# EAGLE schematic MotorBoard (EAGLE 9.2.1)
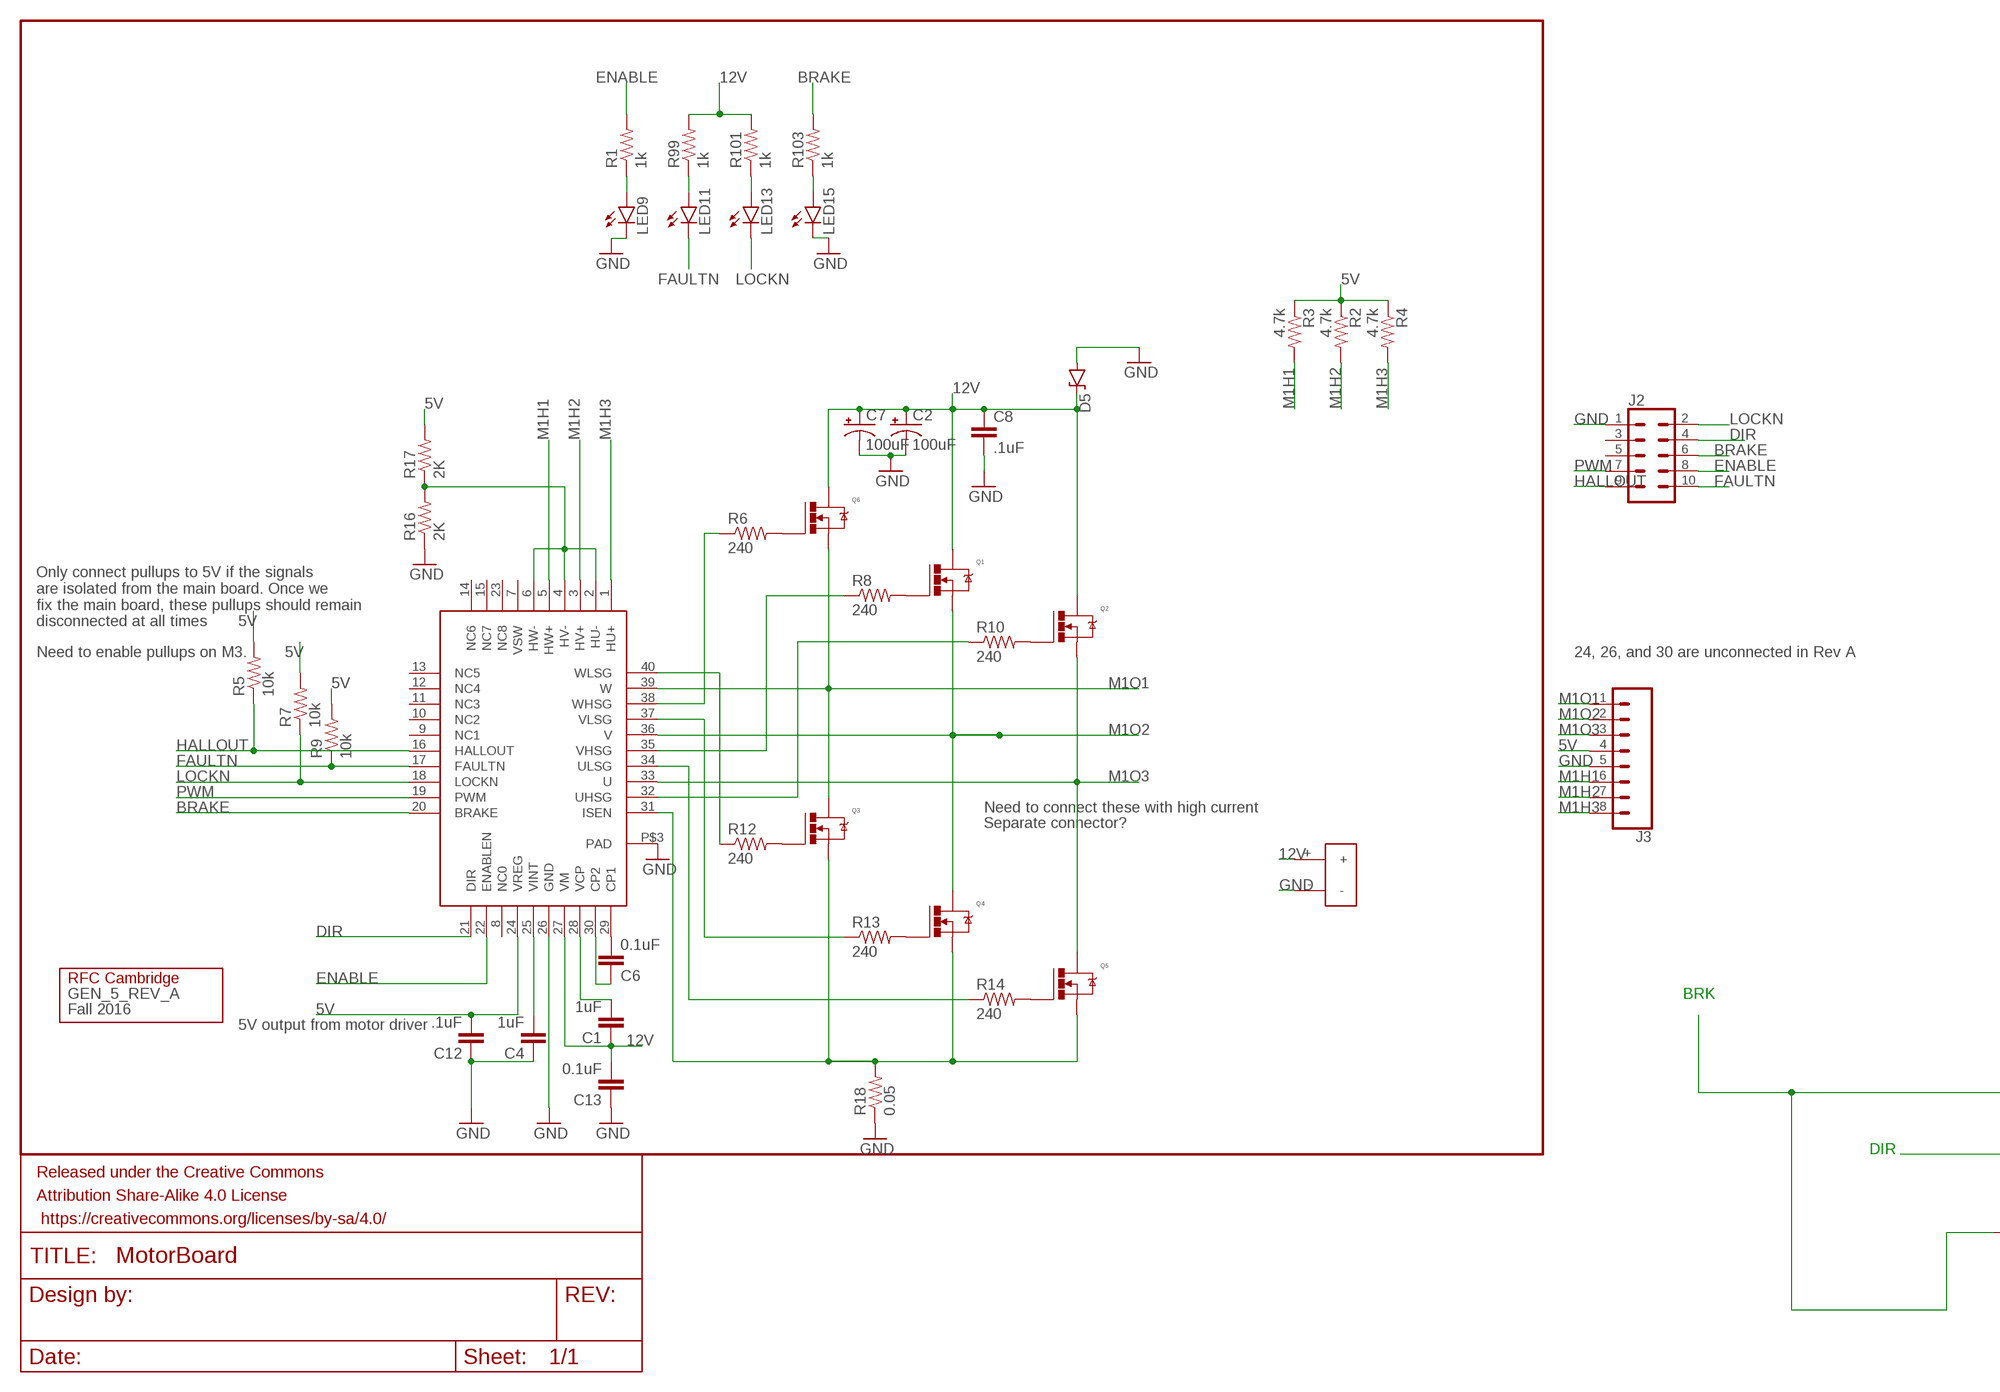
[diagram p0: schematic, sheet 1, part 1 of 2]
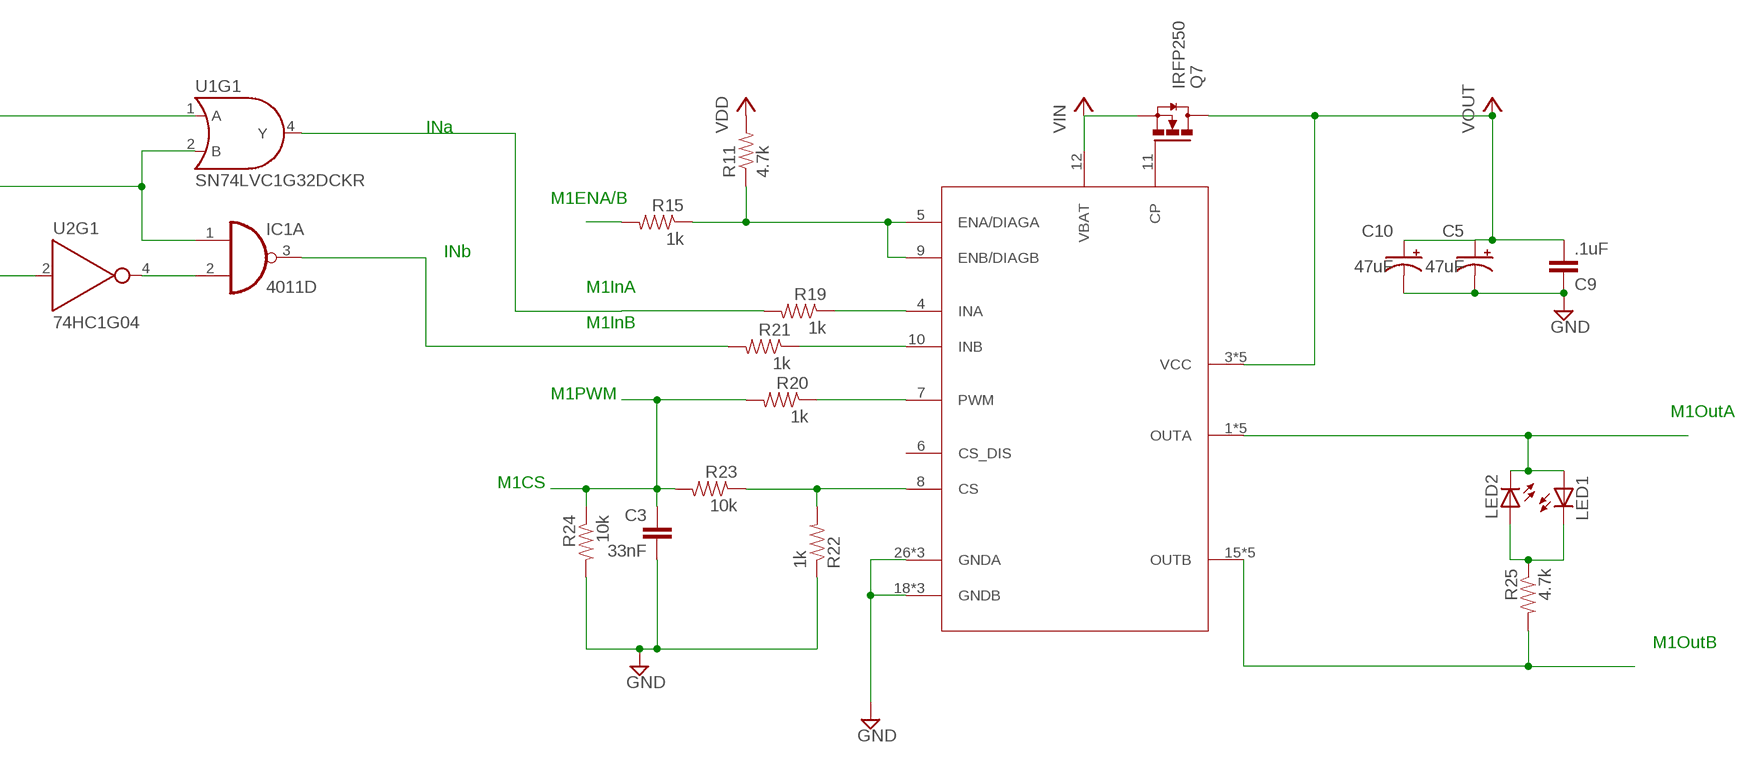
[diagram p1: schematic, sheet 1, part 2 of 2]

## Parts
C1  1uF  CAP0805  [0805]
C2  100uF  CAP-POLAR  [PANASONIC_D]
C3  33nF  CAP0805  [0805]
C4  1uF  CAP0805  [0805]
C5  47uF  CPOL-US085CS-1AW  [085CS_1AW]
C6  0.1uF  CAP0805  [0805]
C7  100uF  CAP-POLAR  [PANASONIC_D]
C8  .1uF  CAP0805  [0805]
C9  .1uF  CAP0805  [0805]
C10  47uF  CPOL-US085CS-1AW  [085CS_1AW]
C12  .1uF  CAP0805  [0805]
C13  0.1uF  CAP0805  [0805]
D5  DIODE-ZENERDO214AC  [DO214AC]
FRAME7  FRAME-LETTER  [CREATIVE_COMMONS]
GEN_5_REV_A  Fall 2016  LOGO  [LOGO]
IC1  4011D  [SO14]
J2  CONN_05X2SHD  [2X5-SHROUDED]
J3  CONN_08LONGPADS  [1X08_LONGPADS]
LED1  LED  [SMARTLED-TTW]
LED2  LED  [SMARTLED-TTW]
LED9  LED1206  [LED-1206]
LED11  LED1206  [LED-1206]
LED13  LED1206  [LED-1206]
LED15  LED1206  [LED-1206]
Q1  N-MOSFET  [DPAK]
Q2  N-MOSFET  [DPAK]
Q3  N-MOSFET  [DPAK]
Q4  N-MOSFET  [DPAK]
Q5  N-MOSFET  [DPAK]
Q6  N-MOSFET  [DPAK]
Q7  IRFP250  [TO-247AD-V]
R1  1k  RESISTOR0805-RES  [0805]
R2  4.7k  RESISTOR0805-RES  [0805]
R3  4.7k  RESISTOR0805-RES  [0805]
R4  4.7k  RESISTOR0805-RES  [0805]
R5  10k  RESISTOR0805-RES  [0805]
R6  240  RESISTOR0805-RES  [0805]
R7  10k  RESISTOR0805-RES  [0805]
R8  240  RESISTOR0805-RES  [0805]
R9  10k  RESISTOR0805-RES  [0805]
R10  240  RESISTOR0805-RES  [0805]
R11  4.7k  RESISTOR0805-RES  [0805]
R12  240  RESISTOR0805-RES  [0805]
R13  240  RESISTOR0805-RES  [0805]
R14  240  RESISTOR0805-RES  [0805]
R15  1k  RESISTOR0805-RES  [0805]
R16  2K  RESISTOR0805-RES  [0805]
R17  2K  RESISTOR0805-RES  [0805]
R18  0.05  R-US_R2512  [R2512]
R19  1k  RESISTOR0805-RES  [0805]
R20  1k  RESISTOR0805-RES  [0805]
R21  1k  RESISTOR0805-RES  [0805]
R22  1k  RESISTOR0805-RES  [0805]
R23  10k  RESISTOR0805-RES  [0805]
R24  10k  RESISTOR0805-RES  [0805]
R25  4.7k  RESISTOR0805-RES  [0805]
R99  1k  RESISTOR0805-RES  [0805]
R101  1k  RESISTOR0805-RES  [0805]
R103  1k  RESISTOR0805-RES  [0805]
U1  SN74LVC1G32DCKR  74LVC32DBV  [SOT23-5]
U2  74HC1G04  [SOT353]
U$1  DRV8307  [QFN40-6X6]
U$2  POWER_CONN_2X1  [POWER_CONN_2X1]
U$3  VNH5019A-E  [MULTIPOWERSO-30]

## Nets
5V: C12.2 J3.4 R2.1 R3.1 R4.1 R5.2 R7.2 R9.2 R17.2 U$1.24(VREG)
12V: C1.1 C2.+ C7.+ C8.1 C13.2 D5.C Q1.DRAIN Q2.DRAIN Q6.DRAIN R99.2 R101.2 U$1.27(VM) U$2.+
+5V: Q7.S R11.2 U$3.12(VBAT) ; supply symbol labelled VIN, VDD
BRAKE: J2.6 R103.2 U$1.20(BRAKE)
DIR: J2.4 U$1.21(DIR)
ENABLE: J2.8 R1.2 U$1.22(ENABLEN)
FAULTN: J2.10 LED11.C R9.1 U$1.17(FAULTN)
GND: C2.- C3.2 C4.1 C5.- C7.- C8.2 C9.1 C10.- C12.1 C13.1 D5.A J2.1 J3.5 LED9.C LED15.C R16.1 R18.1 R22.1 R24.2 U$1.26(GND) U$1.P$3(PAD) U$2.- U$3.18(GNDB) U$3.19(GNDB) U$3.20(GNDB) U$3.26(GNDA) U$3.27(GNDA) U$3.28(GNDA)
HALLOUT: J2.9 R5.1 U$1.16(HALLOUT)
LOCKN: J2.2 LED13.C R7.1 U$1.18(LOCKN)
M1H1: J3.6 R3.2 U$1.5(HW+)
M1H2: J3.7 R2.2 U$1.3(HV+)
M1H3: J3.8 R4.2 U$1.1(HU+)
M1O1: J3.1 Q3.DRAIN Q6.SOURCE U$1.39(W)
M1O2: J3.2 Q1.SOURCE Q4.DRAIN U$1.36(V)
M1O3: J3.3 Q2.SOURCE Q5.DRAIN U$1.33(U)
N$1: LED9.A R1.1
N$2: C6.2 U$1.29(CP1)
N$3: Q7.G U$3.11(CP)
N$4: C1.2 U$1.28(VCP)
N$6: Q6.GATE R6.2
N$7: Q1.GATE R8.2
N$8: R15.2
N$9: C6.1 U$1.30(CP2)
N$10: Q2.GATE R10.2
N$11: Q3.GATE R12.2
N$13: Q4.GATE R13.2
N$14: Q5.GATE R14.2
N$15: C4.2 U$1.25(VINT)
N$16: R6.1 U$1.38(WHSG)
N$17: R14.1 U$1.34(ULSG)
N$18: R13.1 U$1.37(VLSG)
N$19: R12.1 U$1.40(WLSG)
N$20: R8.1 U$1.35(VHSG)
N$21: R10.1 U$1.32(UHSG)
N$22: R16.2 R17.1 U$1.2(HU-) U$1.4(HV-) U$1.6(HW-)
N$23: R11.1 R15.1 U$3.5(ENA/DIAGA) U$3.9(ENB/DIAGB)
N$24: R19.1 U$3.4(INA)
N$25: U1.1(A) U2.2(A)
N$26: IC1.2(A:I1) U2.4(Y)
N$27: IC1.1(A:I0) U1.2(B)
N$28: R19.2 U1.4(Y)
N$29: IC1.3(A:O) R21.2
N$30: R21.1 U$3.10(INB)
N$32: R20.1 U$3.7(PWM)
N$34: R22.2 R23.1 U$3.8(CS)
N$35: C3.1 R20.2 R23.2 R24.1
N$36: C5.+ C9.2 C10.+ Q7.D U$3.3(VCC) U$3.13(VCC) U$3.23(VCC) U$3.VCC U$3.VCC@1(VCC) ; supply symbol labelled VOUT
N$37: R25.2 U$3.15(OUTB) U$3.16(OUTB) U$3.21(OUTB) U$3.OUTB U$3.OUTB@1(OUTB)
N$38: LED1.C@1(C) LED2.A@1(A) R25.1
N$39: LED1.A@1(A) LED2.C@1(C) U$3.1(OUTA) U$3.25(OUTA) U$3.30(OUTA) U$3.OUTA U$3.OUTA@1(OUTA)
N$114: LED11.A R99.1
N$117: LED13.A R101.1
N$119: LED15.A R103.1
O1: Q3.SOURCE Q4.SOURCE Q5.SOURCE R18.2 U$1.31(ISEN)
PWM: J2.7 U$1.19(PWM)
Unconnected: IC1.4(B:O) IC1.5(B:I0) IC1.6(B:I1) IC1.8(C:I0) IC1.9(C:I1) IC1.10(C:O) IC1.11(D:O) IC1.12(D:I0) IC1.13(D:I1) J2.3 J2.5 U1.3(P$V-) U1.5(P$V+) U2.3(P$V-) U2.5(P$V+) U$1.7(VSW) U$1.8(NC0) U$1.9(NC1) U$1.10(NC2) U$1.11(NC3) U$1.12(NC4) U$1.13(NC5) U$1.14(NC6) U$1.15(NC7) U$1.23(NC8) U$3.6(CS_DIS)

## Notes on the sheet
- Only connect pullups to 5V if the signals
  are isolated from the main board. Once we 
  fix the main board, these pullups should remain
  disconnected at all times
- Need to enable pullups on M3. | 24, 26, and 30 are unconnected in Rev A
- Need to connect these with high current
- Separate connector?
- BRK
- 5V output from motor driver
- INa
- DIR
- M1ENA/B
- INb
- M1InA
- M1InB
- M1PWM
- M1OutA
- M1CS
- M1OutB

## Power pins joined to a net without a drawn wire
VDD: IC1.14(P:VDD)
VSS: IC1.7(P:VSS)

## Library data of the parts
C1 C3 C4 C6 C8 C9 C12 C13 = SparkFun-Passives:CAP: Capacitor Standard 0603 ceramic capacitor, and 0.1" leaded capacitor.
C2 C7 = gen3:CAP-POLAR: Cap Alum Polarized Digikey: 493-3953-1-ND low impedence, low ceiling cap; PROD_ID: CAP-10547
C5 C10 = rcl:CPOL-US: POLARIZED CAPACITOR, American symbol; SPICEPREFIX: C
D5 = gen3:DIODE-ZENER: Zener Diode Production Part - 8199 3.4V Zener Voltage
FRAME7 = SparkFun-Aesthetics:FRAME-LETTER: Schematic Frame Standard 8.5x11 US Letter frame
GEN_5_REV_A = gen3:LOGO
IC1 = 40xx:4011: Quad 2-input NAND
J2 = SparkFun-Connectors:CONN_05X2: Multi connection point. Often used as Generic Header-pin footprint for 0.1 inch spaced/style header connections For AVR SPI programming port, see special device with nice symbol: "AVR_SPI_PROG_5x2.dev" You can populate with any combo of single row headers, but if you'd like an exact match, check these: 2x5 AVR ICSP Male Header <https://www.sparkfun.com/products/778> (PRT-00778) 2x5 Pin Shrouded Header <https://www.sparkfun.com/products/8506> (PRT-08506) On any of the 0.1 inch spaced packages, you can populate with these: Break Away Headers - Straight <https://www.sparkfun.com/products/116> (PRT-00116) Break Away Male Headers - Right Angle <https://www.sparkfun.com/products/553> (PRT-00553) Female Headers <https://www.sparkfun.com/products/115> (PRT-00115) Break Away Headers - Machine Pin <https://www.sparkfun.com/products/117> (PRT-00117) Break Away Female Headers - Swiss Machine Pin <https://www.sparkfun.com/products/743> (PRT-00743) Special note: the shrouded connector mates well with our 5x2 ribbon cables: 2x5 Pin IDC Ribbon Cable <https://www.sparkfun.com/products/8535> (PRT-08535); PROD_ID: CONN-08671; SF_ID: PRT-08506
J3 = SparkFun-Connectors:CONN_08: Multi connection point. Often used as Generic Header-pin footprint for 0.1 inch spaced/style header connections On any of the 0.1 inch spaced packages, you can populate with these: Break Away Headers - Straight <https://www.sparkfun.com/products/116> (PRT-00116) Break Away Male Headers - Right Angle <https://www.sparkfun.com/products/553> (PRT-00553) Female Headers <https://www.sparkfun.com/products/115> (PRT-00115) Break Away Headers - Machine Pin <https://www.sparkfun.com/products/117> (PRT-00117) Break Away Female Headers - Swiss Machine Pin <https://www.sparkfun.com/products/743> (PRT-00743) Arduino Stackable Header - 8 Pin <https://www.sparkfun.com/products/9279> (PRT-09279) For SCREWTERMINALS and SPRING TERMINALS visit here: Screw Terimnals on SparkFun.com <https://www.sparkfun.com/search/results?term=Screw+Terminals> (5mm/3.5mm/2.54mm spacing) This device is also useful as a general connection point to wire up your design to another part of your project. Our various solder wires solder well into these plated through hole pads. Hook-Up Wire - Assortment (Stranded, 22 AWG) <https://www.sparkfun.com/products/11375> (PRT-11375) Hook-Up Wire - Assortment (Solid Core, 22 AWG) <https://www.sparkfun.com/products/11367> (PRT-11367) View the entire wire category on our website here <https://www.sparkfun.com/categories/141> Special notes: Molex polarized connector foot print use with SKU : PRT-08231 with associated crimp pins and housings. 1MM SMD Version SKU: PRT-10208 NOTES ON THE VARIANTS LOCK and LOCK_LONGPADS... This footprint was designed to help hold the alignment of a through-hole component (i.e. 6-pin header) while soldering it into place. You may notice that each hole has been shifted either up or down by 0.005 of an inch from it's more standard position (which is a perfectly straight line). This slight alteration caused the pins (the squares in the middle) to touch the edges of the holes. Because they are alternating, it causes a "brace" to hold the component in place. 0.005 has proven to be the perfect amount of "off-center" position when using our standard breakaway headers. Although looks a little odd when you look at the bare footprint, once you have a header in there, the alteration is very hard to notice. Also,if you push a header all the way into place, it is covered up entirely on the bottom side.
LED1 LED2 = led:LED: LED OSRAM: - CHIPLED LG R971, LG N971, LY N971, LG Q971, LY Q971, LO R971, LY R971 LH N974, LH R974 LS Q976, LO Q976, LY Q976 LO Q996 - Hyper CHIPLED LW Q18S LB Q993, LB Q99A, LB R99A - SideLED LS A670, LO A670, LY A670, LG A670, LP A670 LB A673, LV A673, LT A673, LW A673 LH A674 LY A675 LS A676, LA A676, LO A676, LY A676, LW A676 LS A679, LY A679, LG A679 - Hyper Micro SIDELED® LS Y876, LA Y876, LO Y876, LY Y876 LT Y87S - SmartLED LW L88C, LW L88S LB L89C, LB L89S, LG L890 LS L89K, LO L89K, LY L89K LS L896, LA L896, LO L896, LY L896 - TOPLED LS T670, LO T670, LY T670, LG T670, LP T670 LSG T670, LSP T670, LSY T670, LOP T670, LYG T670 LG T671, LOG T671, LSG T671 LB T673, LV T673, LT T673, LW T673 LH T674 LS T676, LA T676, LO T676, LY T676, LB T676, LH T676, LSB T676, LW T676 LB T67C, LV T67C, LT T67C, LS T67K, LO T67K, LY T67K, LW E67C LS E67B, LA E67B, LO E67B, LY E67B, LB E67C, LV E67C, LT E67C LW T67C LS T679, LY T679, LG T679 LS T770, LO T770, LY T770, LG T770, LP T770 LB T773, LV T773, LT T773, LW T773 LH T774 LS E675, LA E675, LY E675, LS T675 LS T776, LA T776, LO T776, LY T776, LB T776 LHGB T686 LT T68C, LB T68C - Hyper Mini TOPLED® LB M676 - Mini TOPLED Santana® LG M470 LS M47K, LO M47K, LY M47K Source: http://www.osram.convergy.de LUXEON: - LUMILED® LXK2-PW12-R00, LXK2-PW12-S00, LXK2-PW14-U00, LXK2-PW14-V00 LXK2-PM12-R00, LXK2-PM12-S00, LXK2-PM14-U00 LXK2-PE12-Q00, LXK2-PE12-R00, LXK2-PE12-S00, LXK2-PE14-T00, LXK2-PE14-U00 LXK2-PB12-K00, LXK2-PB12-L00, LXK2-PB12-M00, LXK2-PB14-N00, LXK2-PB14-P00, LXK2-PB14-Q00 LXK2-PR12-L00, LXK2-PR12-M00, LXK2-PR14-Q00, LXK2-PR14-R00 LXK2-PD12-Q00, LXK2-PD12-R00, LXK2-PD12-S00 LXK2-PH12-R00, LXK2-PH12-S00 LXK2-PL12-P00, LXK2-PL12-Q00, LXK2-PL12-R00 Source: www.luxeon.com KINGBRIGHT: KA-3528ASYC Source: www.kingbright.com
LED9 LED11 LED13 LED15 = SparkFun-LED:LED: LEDs Standard schematic elements and footprints for 5mm, 3mm, 1206, and 0603 sized LEDs. 5mm - Spark Fun Electronics SKU : COM-00529 (and others)
Q1-Q6 = rfc:N-MOSFET: N-Channel Power Mosfet
Q7 = transistor-power:IRFP25*: 33A/27A, 200V/150V, 0.085/0.012 Ohm, N-Channel Power MOSFET Source: Fairchild Semiconductor Corporation
R1 R99 R101 R103 = SparkFun-Passives:RESISTOR: Resistor Basic schematic elements and footprints for 0603, 1206, and PTH resistors.
R2-R17 R19-R25 = SparkFun-Resistors:RESISTOR: Resistor Basic schematic elements and footprints for 0603, 1206, and PTH resistors.
R18 = resistor:R-US_: RESISTOR, American symbol
U1 = SparkFun-IC-Logic:74*32: Single OR gate IC POSITIVE-OR GATE 2-IN SC-70 SparkFun Products SparkFun Stepoko <https://www.sparkfun.com/products/13899> (ROB-13899) SparkFun LogicBlocks Kit <https://www.sparkfun.com/products/11006> (KIT-11006); PROD_ID: IC-10842
U2 = SparkFun-IC-Logic:74*1G04: Single Inverter IC NOT GATE INVERTER SNGL 1IN SOT353 Supply: 1.65V to 5.5V Datasheet <http://diodes.com/datasheets/74LVC1G04.pdf> SparkFun Products SparkFun Stepoko <https://www.sparkfun.com/products/13899> (ROB-13899) SparkFun CryptoShield <https://www.sparkfun.com/products/13183> (DEV-13183) SparkFun LogicBlocks Kit <https://www.sparkfun.com/products/11006> (KIT-11006) SparkFun ArduMoto <https://www.sparkfun.com/products/9815> (DEV-09815); PROD_ID: COMP-08268
U$1 = texas2:DRV8307
U$2 = Kicker:POWER_CONN_2X1
U$3 = new-st:VNH5019A-E: New part